# EAGLE design Electronics-final (EAGLE 9.1.3)
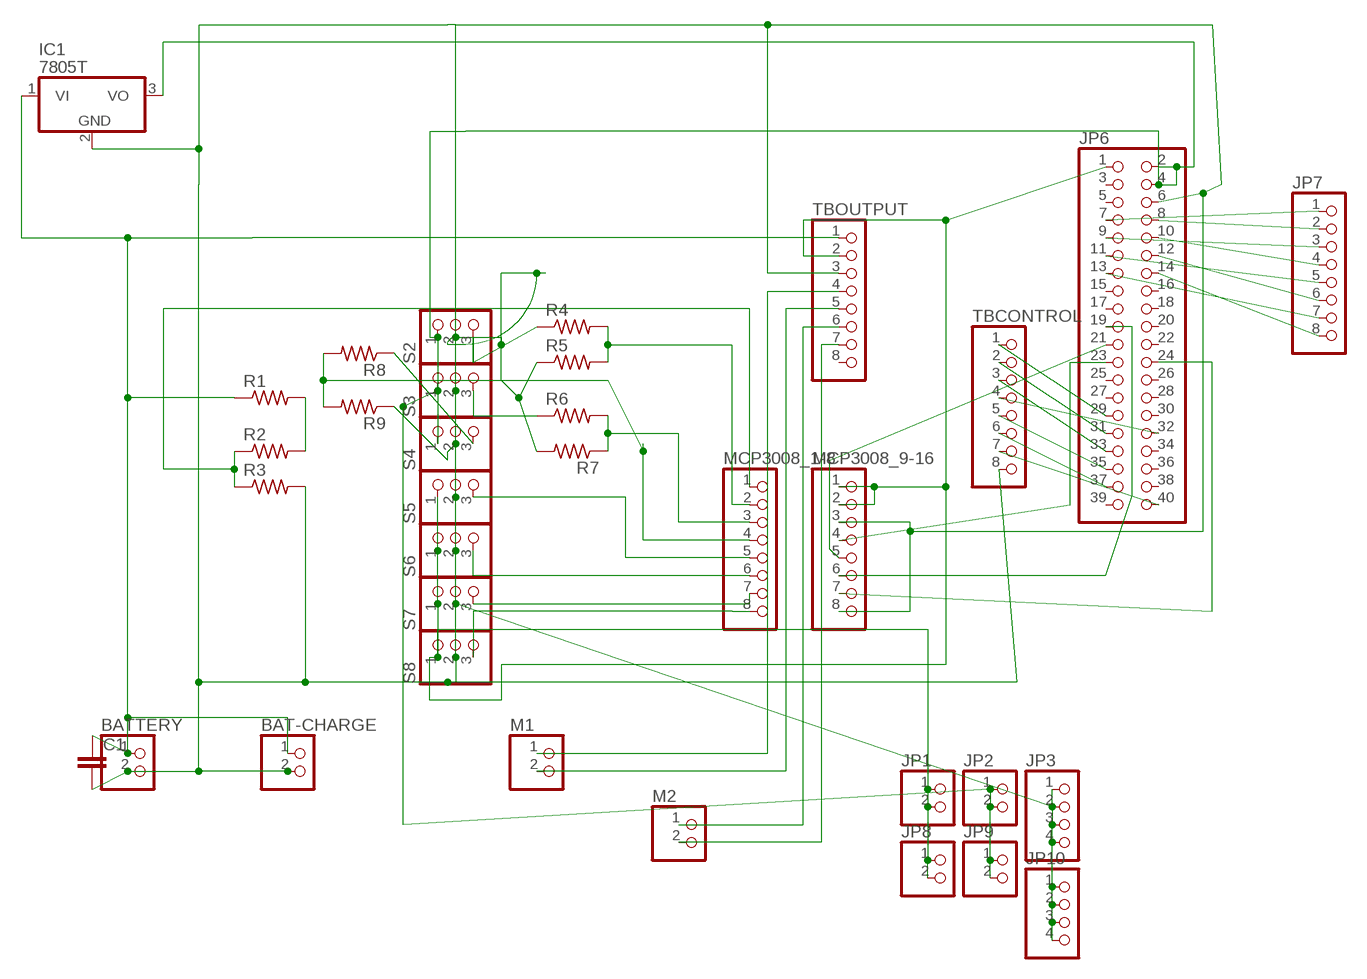
[diagram p0: schematic, sheet 1]

## Parts
BAT-CHARGE  PINHD-1X2  [1X02]
BATTERY  PINHD-1X2  [1X02]
C1  C-EU050-035X075  [C050-035X075]
IC1  7805T  [TO220H]
JP1  PINHD-1X2  [1X02]
JP2  PINHD-1X2  [1X02]
JP3  PINHD-1X4  [1X04]
JP6  PINHD-2X20  [2X20]
JP7  PINHD-1X8  [1X08]
JP8  PINHD-1X2  [1X02]
JP9  PINHD-1X2  [1X02]
JP10  PINHD-1X4  [1X04]
M1  PINHD-1X2  [1X02]
M2  PINHD-1X2  [1X02]
MCP3008_1-8  PINHD-1X8  [1X08]
MCP3008_9-16  PINHD-1X8  [1X08]
R1  R-US_0204/7  [0204/7]
R2  R-US_0204/7  [0204/7]
R3  R-US_0204/7  [0204/7]
R4  R-US_0204/7  [0204/7]
R5  R-US_0204/7  [0204/7]
R6  R-US_0204/7  [0204/7]
R7  R-US_0204/7  [0204/7]
R8  R-US_0204/7  [0204/7]
R9  R-US_0204/7  [0204/7]
S2  PINHD-1X3  [1X03]
S3  PINHD-1X3  [1X03]
S4  PINHD-1X3  [1X03]
S5  PINHD-1X3  [1X03]
S6  PINHD-1X3  [1X03]
S7  PINHD-1X3  [1X03]
S8  PINHD-1X3  [1X03]
TBCONTROL  PINHD-1X8  [1X08]
TBOUTPUT  PINHD-1X8  [1X08]

## Nets
3.3V: JP1.1 JP1.2 JP6.1 JP8.1 JP8.2 MCP3008_9-16.1 MCP3008_9-16.2 S5.1 S6.1 S7.1 S8.1 TBOUTPUT.2
5V: IC1.3(VO) JP2.1 JP2.2 JP6.2 JP6.4 JP9.1 JP9.2 S2.1 S3.1 S4.1
7: JP6.7 JP7.1
8: JP6.8 JP7.2
9: JP6.9 JP7.3
10: JP6.10 JP7.4
11: JP6.11 JP7.5
12: JP6.12 JP7.6
13: JP6.13 JP7.7
14: JP6.14 JP7.8
GND: BAT-CHARGE.2 BATTERY.2 C1.2 IC1.2(GND) JP3.1 JP3.2 JP3.3 JP3.4 JP6.6 JP10.1 JP10.2 JP10.3 JP10.4 MCP3008_9-16.3 MCP3008_9-16.8 R3.2 R5.1 R7.2 R9.1 S2.2 S3.2 S4.2 S5.2 S6.2 S7.2 S8.2 TBCONTROL.8 TBOUTPUT.3
N$1: JP6.40 TBCONTROL.7
N$2: JP6.32 TBCONTROL.4
N$4: R1.2 R2.2
N$5: JP6.37 TBCONTROL.6
N$6: JP6.35 TBCONTROL.5
N$7: JP6.33 TBCONTROL.3
N$8: JP6.31 TBCONTROL.2
N$10: JP6.29 TBCONTROL.1
N$12: JP6.23 MCP3008_9-16.4
N$20: JP6.21 MCP3008_9-16.5
N$22: M1.1 TBOUTPUT.4
N$23: M1.2 TBOUTPUT.5
N$24: M2.1 TBOUTPUT.6
N$25: M2.2 TBOUTPUT.7
N$26: JP6.19 MCP3008_9-16.6
N$27: JP6.24 MCP3008_9-16.7
S1: R4.1 S2.3
S1H: MCP3008_1-8.2 R4.2 R5.2
S2: R6.1 S3.3
S2H: MCP3008_1-8.3 R6.2 R7.1
S3: R8.1 S4.3
S3H: MCP3008_1-8.4 R8.2 R9.2
S4: MCP3008_1-8.5 S5.3
S5: MCP3008_1-8.6 S6.3
S6: MCP3008_1-8.7 S7.3
S7: MCP3008_1-8.8 S8.3
VIN: BAT-CHARGE.1 BATTERY.1 C1.1 IC1.1(VI) R1.1 TBOUTPUT.1
VINH: MCP3008_1-8.1 R2.1 R3.1
Unconnected: JP6.3 JP6.5 JP6.15 JP6.16 JP6.17 JP6.18 JP6.20 JP6.22 JP6.25 JP6.26 JP6.27 JP6.28 JP6.30 JP6.34 JP6.36 JP6.38 JP6.39 TBOUTPUT.8

## Library data of the parts
BAT-CHARGE BATTERY JP1 JP2 JP8 JP9 M1 M2 = pinhead:PINHD-1X2: PIN HEADER
C1 = resistor:C-EU: CAPACITOR, European symbol
IC1 = linear:78*: Positive VOLTAGE REGULATOR Source: http://cache.national.com/ds/LM/LM78L05.pdf http://www.fairchildsemi.com/ds/LM/LM7805.pdf
JP3 JP10 = pinhead:PINHD-1X4: PIN HEADER
JP6 = pinhead:PINHD-2X20: PIN HEADER
JP7 MCP3008_1-8 MCP3008_9-16 TBCONTROL TBOUTPUT = pinhead:PINHD-1X8: PIN HEADER
R1-R9 = resistor:R-US_: RESISTOR, American symbol
S2-S8 = pinhead:PINHD-1X3: PIN HEADER

## Board
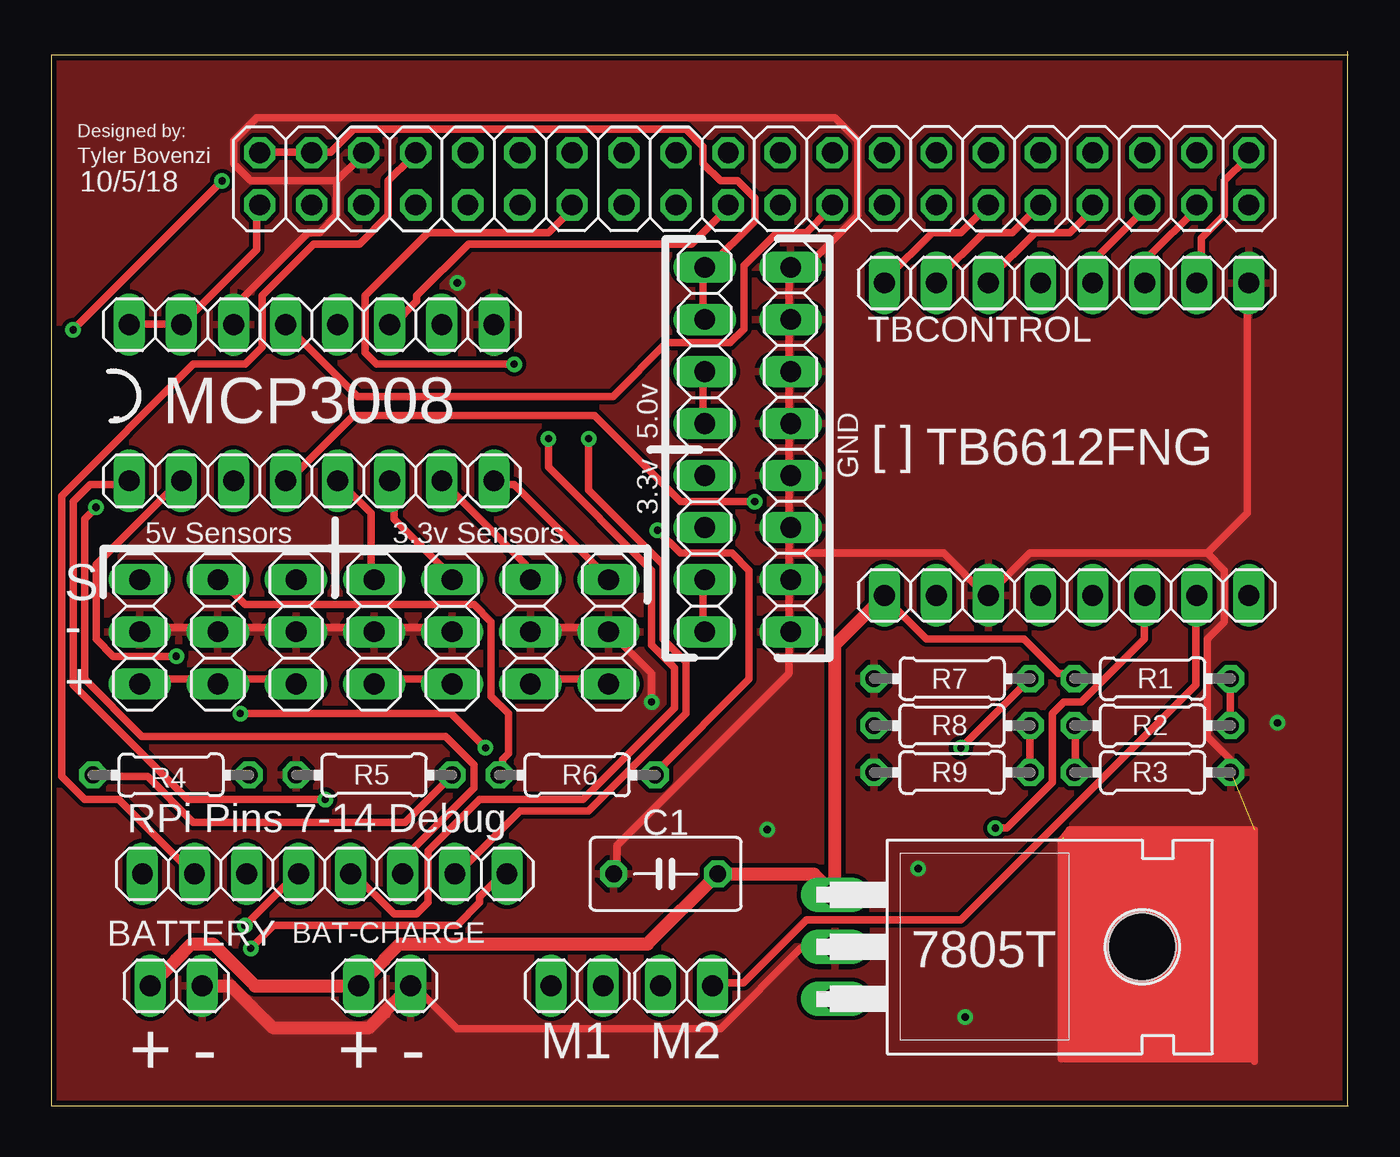
[diagram p1: board, top side]
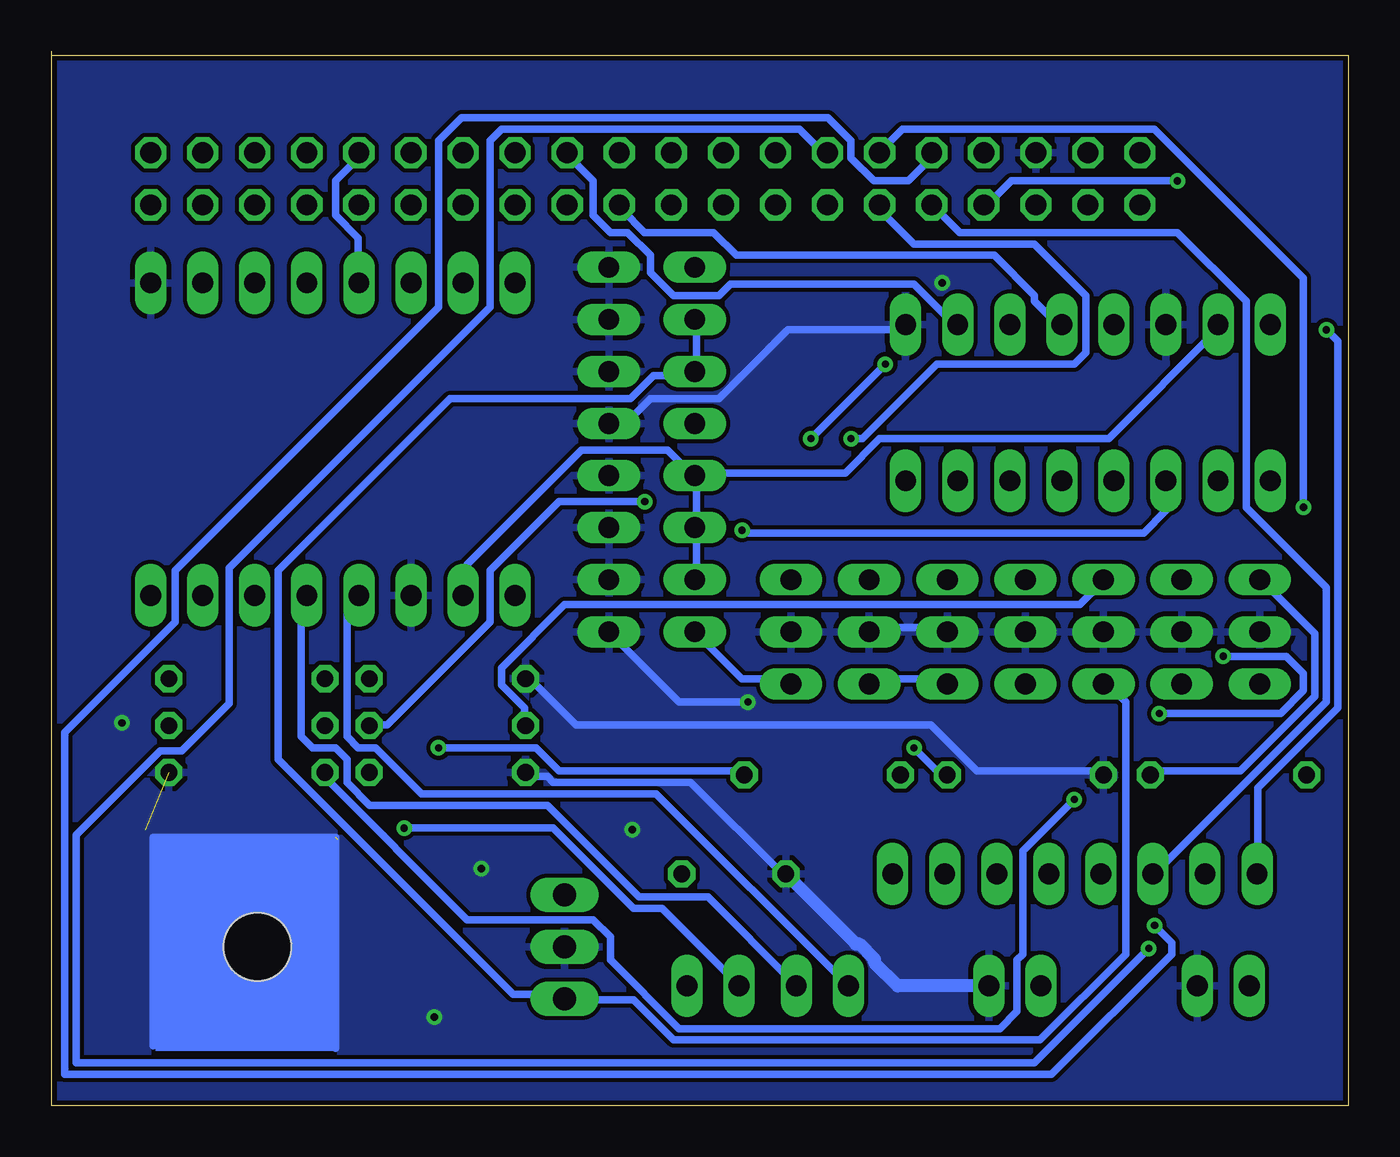
[diagram p2: board, bottom side, seen from below]

Size 63.27 x 51.44 mm. Coordinates in mm from the lower left corner, seen from the top.
Outline: 63.27,0 0,0 0,51.23 63.27,51.23
Outline: 63.25,0 63.25,51.44
Copper layers (1*16): Top 0.035mm / dielectric 1.5mm / Bottom 0.035mm
Design rules "default *": minimum track width 14mil, minimum drill 0.35mm, track to track 8mil, track to pad 8mil, pad to pad 12mil, via to via 12mil, smd to smd 4mil, copper to edge 10mil, drill to drill 6mil, minimum pad ring 10mil, minimum via ring 8mil, stop-mask expansion 4mil, vias tented up to drill 0mil, thermal gap 10mil

### Footprints (pad centres in the part's own frame; a part is rotated, then mirrored left to right if it is on the bottom)
1X02 = drill 1.016 long: 1 -1.27,0; 2 1.27,0
C050-035X075 = drill 0.813 octagon: 1 -2.54,0; 2 2.54,0
TO220H = drill 1.118 long: 1 -2.54,-10.16; 2 0,-10.16; 3 2.54,-10.16 | hole 3.302: 0,4.826
1X04 = drill 1.016 long: 1 -3.81,0; 2 -1.27,0; 3 1.27,0; 4 3.81,0
2X20 = drill 1.016 octagon: 1 -24.13,-1.27; 2 -24.13,1.27; 3 -21.59,-1.27; 4 -21.59,1.27; 5 -19.05,-1.27; 6 -19.05,1.27; 7 -16.51,-1.27; 8 -16.51,1.27; 9 -13.97,-1.27; 10 -13.97,1.27; 11 -11.43,-1.27; 12 -11.43,1.27; 13 -8.89,-1.27; 14 -8.89,1.27; 15 -6.35,-1.27; 16 -6.35,1.27; 17 -3.81,-1.27; 18 -3.81,1.27; 19 -1.27,-1.27; 20 -1.27,1.27; 21 1.27,-1.27; 22 1.27,1.27; 23 3.81,-1.27; 24 3.81,1.27; 25 6.35,-1.27; 26 6.35,1.27; 27 8.89,-1.27; 28 8.89,1.27; 29 11.43,-1.27; 30 11.43,1.27; 31 13.97,-1.27; 32 13.97,1.27; 33 16.51,-1.27; 34 16.51,1.27; 35 19.05,-1.27; 36 19.05,1.27; 37 21.59,-1.27; 38 21.59,1.27; 39 24.13,-1.27; 40 24.13,1.27
1X08 = drill 1.016 long: 1 -8.89,0; 2 -6.35,0; 3 -3.81,0; 4 -1.27,0; 5 1.27,0; 6 3.81,0; 7 6.35,0; 8 8.89,0
0204/7 = drill 0.813 octagon: 1 -3.81,0; 2 3.81,0
1X03 = drill 1.016 long: 1 -2.54,0; 2 0,0; 3 2.54,0

### Placement (x,y rotation side)
BAT-CHARGE  16.26,5.84 0 top
BATTERY  6.1,5.84 0 top
C1  29.97,11.3 180 top
IC1  48.39,7.75 270 top
JP1  31.88,29.46 90 top
JP2  31.88,34.54 90 top
JP3  36.07,37.08 270 top
JP6  34.29,45.21 0 top
JP7  13.33,11.3 0 top
JP8  31.88,24.38 90 top
JP9  31.88,39.62 90 top
JP10  36.07,26.92 270 top
M1  25.65,5.84 0 top
M2  30.99,5.84 0 top
MCP3008_1-8  12.7,30.48 0 top
MCP3008_9-16  12.7,38.1 0 top
R1  53.72,20.83 0 top
R2  53.72,18.54 0 top
R3  53.72,16.26 0 top
R4  5.84,16.13 180 top
R5  15.75,16.13 0 top
R6  25.65,16.13 0 top
R7  43.94,20.83 180 top
R8  43.94,18.54 0 top
R9  43.94,16.26 0 top
S2  4.32,23.11 90 top
S3  8.13,23.11 90 top
S4  11.94,23.11 90 top
S5  15.75,23.11 90 top
S6  19.56,23.11 90 top
S7  23.37,23.11 90 top
S8  27.18,23.11 90 top
TBCONTROL  49.53,40.13 0 top
TBOUTPUT  49.53,24.89 0 top

### Tracks (layer width: path | path; a pad name or v marks a point on that pad's centre or on a via)
3.3V
  Top 0.356: MCP3008_9-16.1 3.86,38.12 6.1,38.12 MCP3008_9-16.2 6.38,38.12 10.01,41.76 10.01,43.71 JP6.1 | S5.1 15.87,20.8 19.51,20.8 S6.1 | S8.1 27.05,20.8 23.42,20.8 S7.1 | JP8.1 31.8,23.32 31.8,25.55 JP8.2
  Bottom 0.356: S7.1 23.14,20.8 19.79,20.8 S6.1 | JP1.2 31.8,30.58 31.8,28.35 JP1.1 31.8,28.07 31.8,25.83 JP8.2 | TBOUTPUT.2 42.98,24.99 42.98,26.39 37.39,31.98 33.2,31.98 32.08,30.86 JP1.2 | S8.1 27.33,20.8 29.57,20.8 31.8,23.04 JP8.1 | MCP3008_9-16.2 6.38,37.85 11.68,32.54 22.86,32.54 24.54,30.86 31.8,30.86 JP1.2
5V
  Top 0.356: JP6.2 10.29,46.51 12.52,46.51 JP6.4 12.8,46.51 13.64,46.51 14.76,47.62 30.96,47.62 31.8,46.79 31.8,45.95 32.64,45.11 33.48,45.11 34.32,44.27 34.32,43.16 32.08,40.92 JP9.2 31.8,40.64 31.8,38.41 JP9.1 | JP2.1 31.8,33.38 31.8,35.61 JP2.2 | S2.1 4.42,20.8 8.05,20.8 S3.1 8.33,20.8 11.68,20.8 S4.1
  Bottom 0.356: JP9.1 31.8,38.12 31.8,35.89 JP2.2 32.08,35.61 33.88,35.61 35,34.49 43.82,34.49 52.2,26.11 52.2,16.89 40.74,5.44 38.23,5.44 IC1.3 38.23,5.16 34.87,5.16 32.92,3.2 15.04,3.2 10.85,7.39 10.85,19.69 11.68,20.52 S4.1
7  (via drill 0.35)
  Top 0.356: v8.33,45.11 v1.07,37.85
  Bottom 0.356: v1.07,37.85 0.51,37.29 0.51,19.41 4.42,15.49 4.42,11.3 JP7.1 | v8.33,45.11 16.43,45.11 17.55,43.99 JP6.7
8
  Top 0.356: JP7.2 6.93,11.3 3.3,14.94 1.63,14.94 0.51,16.05 0.51,29.74 6.93,36.17 9.45,36.17 10.29,37.01 10.29,39.52 12.8,42.04 15.04,42.04 16.43,43.43 16.43,45.11 17.55,46.23 JP6.8
9
  Bottom 0.356: JP7.3 9.45,11.3 1.07,19.69 1.07,25.27 4.98,29.19 4.98,39.24 8.33,42.6 18.95,42.6 20.07,43.71 JP6.9
10  (via drill 0.35)
  Top 0.356: v9.45,8.79 11.96,11.3 JP7.4
  Bottom 0.356: v9.45,8.79 8.61,7.95 8.61,7.39 14.48,1.52 62.61,1.52 62.61,18.21 57.23,23.6 57.23,26.11 44.37,38.96 44.37,47.07 43.26,48.18 25.38,48.18 24.26,47.07 24.26,46.23 23.14,45.11 21.46,45.11 20.34,46.23 JP6.10
11  (via drill 0.35)
  Top 0.356: v24.26,32.54 24.26,31.14 29.29,26.11 29.29,22.48 30.4,21.36 30.4,19.41 25.93,14.94 20.9,14.94 18.39,12.42 18.39,9.91 17.83,9.35 16.71,9.35 14.76,11.3 JP7.5
  Bottom 0.356: v24.26,32.54 23.7,32.54 20.07,36.17 13.36,36.17 12.8,36.73 12.8,39.52 15.32,42.04 21.18,42.04 22.86,43.71 JP6.11
12  (via drill 0.35)
  Top 0.356: v2.18,29.19 1.63,28.63 1.63,20.8 4.42,18.01 19.23,18.01 20.62,16.61 20.62,15.49 17.27,12.14 17.27,11.3 JP7.6
  Bottom 0.356: v2.18,29.19 2.18,40.36 9.45,47.62 21.74,47.62 22.86,46.51 JP6.12
13  (via drill 0.35)
  Top 0.356: v26.21,32.54 26.21,30.02 29.84,26.39 29.84,22.76 30.96,21.64 30.96,19.13 26.21,14.38 22.86,14.38 19.79,11.3 JP7.7 | v22.58,36.17 15.87,36.17 15.32,36.73 15.32,39.52 18.39,42.6 24.26,42.6 25.38,43.71 JP6.13
  Bottom 0.356: v22.58,36.17 v26.21,32.54
14  (via drill 0.35)
  Top 0.356: v9.73,7.67 10.85,8.79 19.79,8.79 20.9,9.91 20.9,10.19 22.02,11.3 JP7.8
  Bottom 0.356: v9.73,7.67 15.32,2.08 62.05,2.08 62.05,13.21 57.96,17.3 56.9,17.3 54.59,19.61 54.59,26.24 41.86,38.96 41.86,47.07 41.3,47.62 26.77,47.62 25.65,46.51 JP6.14
GND  (via drill 0.35)  (2 unrouted)
  Top 0.356: 56.39,26.95 57.23,26.11 57.23,23.6 56.39,22.76 56.39,18.01 57.51,16.89 57.51,16.33 R3.2 | 56.39,26.95 47.73,26.95 45.77,24.99 TBOUTPUT.3 45.49,24.99 43.54,26.95 35.99,26.95 | 56.39,26.95 58.34,28.91 58.34,40.08 TBCONTROL.8 | IC1.2 38.23,7.67 36.55,7.67 32.64,3.76 19.79,3.76 17.83,5.71 BAT-CHARGE.2 | S2.2 4.42,23.32 8.05,23.32 S3.2 8.33,23.32 11.68,23.32 S4.2 11.96,23.32 15.6,23.32 S5.2 15.87,23.32 19.51,23.32 S6.2 | S7.2 23.42,23.32 27.05,23.32 S8.2 27.33,23.04 29.29,21.08 v29.29,19.69 | 13.92,45.11 13.92,43.43 13.08,42.6 12.52,42.6 8.89,38.96 8.89,38.12 MCP3008_9-16.3 | 13.92,45.11 15.04,46.23 JP6.6 | 35.99,26.95 35.99,28.07 JP10.2 35.99,28.35 35.99,30.58 JP10.1 35.99,30.86 35.99,33.1 JP3.4 35.99,33.38 35.99,35.61 JP3.3 35.99,35.89 35.99,38.12 JP3.2 35.99,38.41 35.99,40.64 JP3.1 36.27,40.92 36.83,40.92 39.34,43.43 39.34,47.07 38.23,48.18 10.01,48.18 8.89,47.07 8.89,45.95 9.73,45.11 13.92,45.11 | 35.99,26.95 35.99,25.83 JP10.3 35.99,25.55 35.99,23.32 JP10.4 35.99,23.04 35.99,21.08 27.61,12.7 27.61,11.3 C1.2 | 58.67,2.16 58.67,13.46 49.66,13.46 49.28,12.95 49.28,2.29 58.55,2.29
  Top 0.635: BATTERY.2 8.76,5.84 10.8,3.8 15.52,3.8 16.27,4.55 16.27,4.59 BAT-CHARGE.2
  Bottom 0.356: R9.1 39.9,16.05 39.07,16.05 38.79,15.77 32.08,15.77 27.61,11.3 C1.2 | S7.2 23.14,23.32 19.79,23.32 S6.2 | MCP3008_9-16.8 21.74,37.85 27.33,37.85 30.68,34.49 34.04,34.49 35.15,33.38 35.99,33.38 JP3.4 | v29.29,19.69 32.64,19.69 35.99,23.04 JP10.4 | 58.29,2.92 58.29,13.08 49.4,13.08 49.4,2.79 | R5.1 11.96,16.33 18.11,16.33 20.34,18.57 37.67,18.57 39.9,20.8 R7.2
  Bottom 0.635: BAT-CHARGE.2 21.97,5.84 23.1,6.97 23.1,7.13 23.85,7.89 24.02,7.89 C1.2
  other vias: 44.58,4.32 59.82,18.67 19.81,40.13 42.29,11.56 34.93,13.46
  pour Bottom: 63.37,0.13 63.37,51.31 0.13,51.31 0.13,0.13
  pour Top: 63.37,0.38 63.37,51.18 0.13,51.18 0.13,0.38
N$1
  Top 0.356: TBCONTROL.7 56.11,40.36 56.11,42.32 57.23,43.43 57.23,45.11 58.34,46.23 JP6.40
N$2
  Bottom 0.356: TBCONTROL.4 48.29,40.36 48.29,42.32 49.4,43.43 49.4,45.11 48.29,46.23 JP6.32
N$4
  Top 0.356: R2.2 57.51,18.57 57.51,20.8 R1.2
N$5
  Top 0.356: TBCONTROL.6 53.59,40.36 53.59,41.48 55.83,43.71 JP6.37
N$6
  Top 0.356: TBCONTROL.5 50.8,40.36 50.8,41.2 53.32,43.71 JP6.35
N$7
  Top 0.356: TBCONTROL.3 45.77,40.36 48.01,42.6 49.68,42.6 50.8,43.71 JP6.33
N$8
  Top 0.356: TBCONTROL.2 43.26,40.36 45.49,42.6 46.89,42.6 48.01,43.71 JP6.31
N$10
  Top 0.356: TBCONTROL.1 40.74,40.36 42.98,42.6 44.37,42.6 45.49,43.71 JP6.29
N$12
  Top 0.356: MCP3008_9-16.4 14.94,34.59 27.41,34.59 30.02,37.21 33.11,37.21 33.78,37.88 33.78,40.99 34.83,42.04 34.85,42.04 35.41,42.6 36.83,42.6 37.95,43.71 JP6.23
N$20
  Bottom 0.356: MCP3008_9-16.5 14.2,38.12 15.32,39.24 15.32,39.52 17.27,41.48 29.84,41.48 30.96,42.6 34.32,42.6 35.43,43.71 JP6.21
N$22
  Bottom 0.356: M1.1 24.54,5.99 33.76,15.21 45.21,15.21 47.45,17.45 48.29,17.45 48.84,18.01 48.84,24.16 48.29,24.71 TBOUTPUT.4
N$23
  Bottom 0.356: M1.2 27.05,5.99 31.24,10.19 34.59,10.19 39.07,14.66 47.73,14.66 48.84,15.77 48.84,16.89 49.4,17.45 50.52,17.45 51.08,18.01 51.08,24.44 50.8,24.71 TBOUTPUT.5
N$24  (via drill 0.35)
  Top 0.356: v46.05,13.54 46.61,13.54 48.84,15.77 48.84,19.13 49.4,19.69 50.24,19.69 53.32,22.76 53.32,24.71 TBOUTPUT.6
  Bottom 0.356: v46.05,13.54 38.79,13.54 34.87,9.63 33.48,9.63 29.84,5.99 M2.1
N$25
  Top 0.356: M2.2 32.36,5.99 33.76,5.99 36.83,9.07 44.37,9.07 55.83,20.52 55.83,24.71 TBOUTPUT.7
N$26
  Top 0.356: MCP3008_9-16.6 16.71,38.12 17.83,39.24 17.83,39.52 20.34,42.04 31.24,42.04 32.92,43.71 JP6.19
N$27
  Bottom 0.356: MCP3008_9-16.7 19.23,38.12 21.18,40.08 30.12,40.08 30.68,39.52 32.92,39.52 34.04,40.64 34.04,41.48 35.15,42.6 35.99,42.6 36.83,43.43 36.83,45.11 37.95,46.23 JP6.24
S1
  Bottom 0.356: R4.1 9.45,16.33 5.26,16.33 1.63,19.96 1.63,23.04 4.14,25.55 S2.3
S1H  (via drill 0.35)
  Top 0.356: R4.2 2.18,16.05 4.7,16.05 6.93,13.82 17.27,13.82 19.51,16.05 R5.2 | v6.1,21.92 3.02,21.92 2.18,22.76 2.18,26.39 6.1,30.3 MCP3008_1-8.2 | v9.22,19.13 19.51,19.13 v21.18,17.45
  Bottom 0.356: v6.1,21.92 3.02,21.92 2.18,21.08 2.18,20.24 3.3,19.13 v9.22,19.13 | v21.18,17.45 19.79,16.05 R5.2
S2
  Top 0.356: R6.1 22.02,16.33 22.02,16.89 22.3,17.17 22.3,19.13 21.46,19.96 21.46,23.6 20.62,24.44 9.45,24.44 8.33,25.55 S3.3
S2H  (via drill 0.35)
  Top 0.356: v44.37,17.45 47.73,20.8 R7.1 | v29.57,28.07 30.68,26.95 33.2,26.95 34.04,26.11 34.04,20.8 29.57,16.33 R6.2
  Bottom 0.356: v44.37,17.45 39.62,17.45 38.51,16.33 29.57,16.33 R6.2 | MCP3008_1-8.3 8.89,29.03 9.98,27.94 29.44,27.94 v29.57,28.07
S3
  Bottom 0.356: R8.1 40.18,18.57 40.18,19.41 41.3,20.52 41.3,21.36 38.23,24.44 13.08,24.44 11.96,25.55 S4.3
S3H  (via drill 0.35)
  Top 0.356: R9.2 47.73,16.33 47.73,18.29 R8.2 | v34.32,29.46 30.68,29.46 26.49,33.66 14.76,33.66 11.68,30.58 MCP3008_1-8.4
  Bottom 0.356: v34.32,29.46 38.51,29.46 41.86,26.11 41.86,23.6 46.89,18.57 47.73,18.57 R8.2
S4
  Top 0.356: S5.3 15.6,25.83 15.6,28.91 14.2,30.3 MCP3008_1-8.5
S5
  Top 0.356: MCP3008_1-8.6 16.71,30.3 16.71,28.63 19.51,25.83 S6.3
S6
  Top 0.356: S7.3 23.14,25.83 23.14,26.39 19.23,30.3 MCP3008_1-8.7
S7
  Top 0.356: MCP3008_1-8.8 21.74,30.3 22.58,30.3 27.05,25.83 S8.3
VIN
  Top 0.356: R1.1 49.68,21.08 49.12,21.08 47.45,22.76 42.7,22.76 40.74,24.71 TBOUTPUT.1
  Top 0.635: BATTERY.1 6.08,7.1 6.08,7.13 6.83,7.89 7.9,7.89 9.94,5.84 BAT-CHARGE.1 16.24,7.1 16.24,7.13 16.99,7.89 29.1,7.89 C1.1 37.21,11.3 IC1.1 38.23,22.48 TBOUTPUT.1
VINH  (via drill 0.35)
  Top 0.356: R3.1 49.96,16.33 49.96,18.29 R2.1 | v13.36,14.94 6.65,14.94 1.07,20.52 1.07,29.46 1.91,30.3 3.58,30.3 MCP3008_1-8.1
  Bottom 0.356: v13.36,14.94 15.87,12.42 15.87,7.39 16.15,7.11 16.15,4.6 16.99,3.76 32.64,3.76 35.99,7.11 35.99,8.23 36.83,9.07 42.98,9.07 49.96,16.05 R3.1
(copper drawn outside any net)
  shapes: Bottom area x1, Top area x1

### Text on the board
tPlace: Designed by: | Tyler Bovenzi | . MCP3008 | 5.0v | [ ] | TB6612FNG | GND | 3.3v | 5v Sensors | 3.3v Sensors | S | - | + | RPi Pins 7-14 Debug | M1 | M2 | + - | + -
tNames: 10/5/18